# Altium schematic sheet USB_HUB.SchDoc
size A4; SheetNumber: 7; SheetTotal: 7
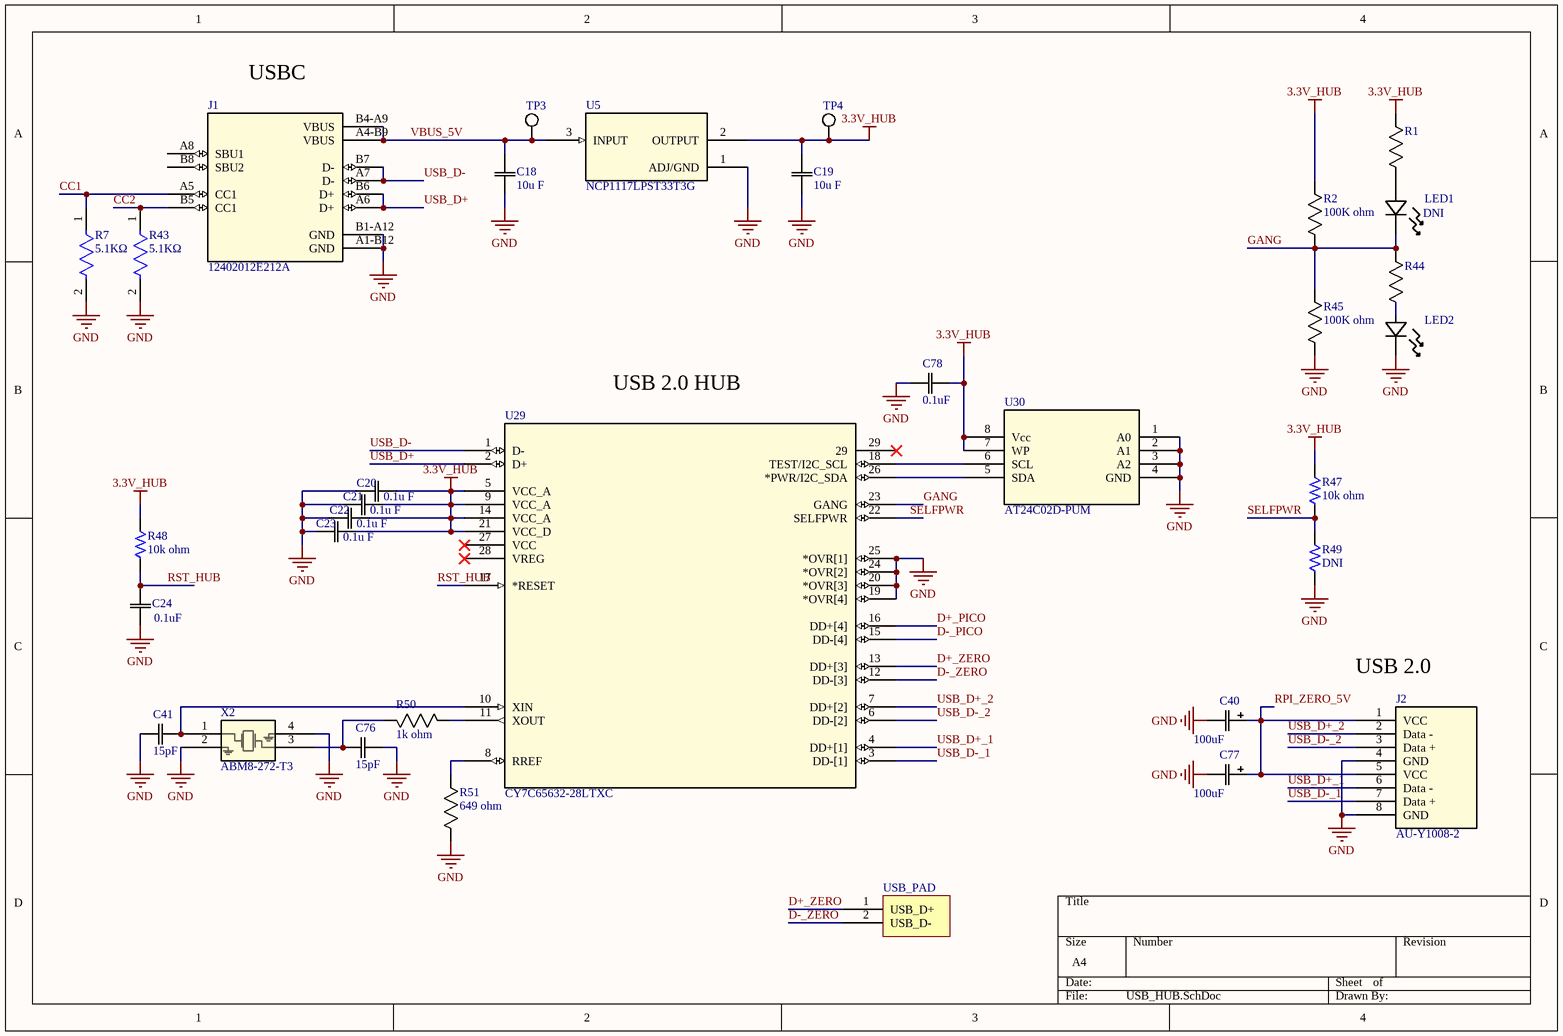
[diagram p0: USB_HUB.SchDoc]

## Parts
C18  value 10u F  [G-21_MUR-M]  (hidden comment: GRM21BR61C106KE15K)
C19  value 10u F  [G-21_MUR-M]  (hidden comment: GRM21BR61C106KE15K)
C20  value 0.1u F  [CC0805N_YAG-M]  (hidden comment: CC0805KRX7R9BB104)
C21  value 0.1u F  [CC0805N_YAG-M]  (hidden comment: CC0805KRX7R9BB104)
C22  value 0.1u F  [CC0805N_YAG-M]  (hidden comment: CC0805KRX7R9BB104)
C23  value 0.1u F  [CC0805N_YAG-M]  (hidden comment: CC0805KRX7R9BB104)
C24  value 0.1uF  [CC0805N_YAG-M]  (hidden comment: CC0805KRX7R9BB104)
C40  value 100uF  [CAP_YX_6P3X11_RUB]  (hidden comment: 35YXJ100M6.3X11)
C41  value 15pF  [CAP_CC0805_YAG-M]  (hidden comment: CC0805FRNPO9BN150)
C76  value 15pF  [CAP_CC0805_YAG-M]  (hidden comment: CC0805FRNPO9BN150)
C77  value 100uF  [CAP_YX_6P3X11_RUB]  (hidden comment: 35YXJ100M6.3X11)
C78  value 0.1uF  [CC0805N_YAG-M]  (hidden comment: CC0805KRX7R9BB104)
J1  12402012E212A  [AMPHENOL_12402012E212A]
J2  AU-Y1008-2  [CONN_AU-Y1008-2_ASM]
LED1  Parameter 1: DNI  [LED_B1931NG_HVK]  (hidden comment: B1931NG--20D001114U1930)
LED2  B1931NG--20D001114U1930  [LED_B1931NG_HVK]  (value not drawn)
R1  RC0603FR-07169RL  [RC0603N_YAG-M]  (value not drawn)
R2  value 100K ohm  [RC0805N_YAG-M]  (hidden comment: RC0805FR-07100KL)
R7  Resistance: 5.1KΩ  [FP-RT0805-MFG]  (hidden comment: RT0805FRE075K1L)
R43  Resistance: 5.1KΩ  [FP-RT0805-MFG]  (hidden comment: RT0805FRE075K1L)
R44  RC0603FR-07169RL  [RC0603N_YAG-M]  (value not drawn)
R45  value 100K ohm  [RC0805N_YAG-M]  (hidden comment: RC0805FR-07100KL)
R47  value 10k ohm  [STA_RNCP0805_STP-M]  (hidden comment: RNCP0805FTD10K0)
R48  value 10k ohm  [STA_RNCP0805_STP-M]  (hidden comment: RNCP0805FTD10K0)
R49  value DNI  [STA_RNCP0805_STP-M]  (hidden comment: RNCP0805FTD10K0)
R50  value 1k ohm  [RES_RNCF0805_STP-M]  (hidden comment: RNCF0805DTE1K00)
R51  value 649 ohm  [RES_RNCF0805_STP-M]  (hidden comment: RLC73K2AR649FTD)
TP3  TestPoint  [Testpoint]  (value not drawn)
TP4  TestPoint  [Testpoint]  (value not drawn)
U5  NCP1117LPST33T3G  [SOT223-3_ONS-M]
U29  CY7C65632-28LTXC  [QFN-28-M]
U30  AT24C02D-PUM  [PDIP8_300MC_MCH]
USB_PAD  USB_PAD  [USB_PAD]  (value not drawn)
X2  ABM8-272-T3  [ABM8-272-T3_ABR]

## Nets
3.3V_HUB: C19.2 C20.1 C21.1 C22.1 C23.1 C78.1 R1.1 R2.2 R47.2 R48.2 TP4.1 U5.2(OUTPUT) U29.5(VCC_A) U29.9(VCC_A) U29.14(VCC_A) U29.21(VCC_D) U30.7(WP) U30.8(Vcc)
GND: C18.1 C19.1 C20.2 C21.2 C22.2 C23.2 C24.1 C40.2 C41.1 C76.2 C77.2 C78.2 J1.A1-B12(GND) J1.B1-A12(GND) J2.4(GND) J2.8(GND) LED2.1(CATHODE) R7.2 R43.2 R45.1 R49.1 R51.1 U5.1(ADJ/GND) U29.19(*OVR[4]) U29.20(*OVR[3]) U29.24(*OVR[2]) U29.25(*OVR[1]) U30.1(A0) U30.2(A1) U30.3(A2) U30.4(GND) X2.2 X2.4
CC1: J1.A5(CC1) R7.1
CC2: J1.B5(CC1) R43.1
D+_PICO: U29.16(DD+[4])
D+_ZERO: U29.13(DD+[3]) USB_PAD.1(USB_D+)
D-_PICO: U29.15(DD-[4])
D-_ZERO: U29.12(DD-[3]) USB_PAD.2(USB_D-)
GANG: LED1.1(CATHODE) R2.1 R44.1 R45.2 U29.23(GANG)
RPI_ZERO_5V: C40.1 C77.1 J2.1(VCC) J2.5(VCC)
RST_HUB: C24.2 R48.1 U29.17(*RESET)
SELFPWR: R47.1 R49.2 U29.22(SELFPWR)
USB_D+: J1.A6(D+) J1.B6(D+) U29.2(D+)
USB_D+_1: J2.6(Data_-) U29.4(DD+[1])
USB_D+_2: J2.2(Data_-) U29.7(DD+[2])
USB_D-: J1.A7(D-) J1.B7(D-) U29.1(D-)
USB_D-_1: J2.7(Data_+) U29.3(DD-[1])
USB_D-_2: J2.3(Data_+) U29.6(DD-[2])
VBUS_5V: C18.2 J1.A4-B9(VBUS) J1.B4-A9(VBUS) TP3.1 U5.3(INPUT)
NetC41_2: C41.2 U29.10(XIN) X2.1
NetC76_1: C76.1 R50.2 X2.3
NetLED1_2: LED1.2(ANODE) R1.2
NetLED2_2: LED2.2(ANODE) R44.2
NetR50_1: R50.1 U29.11(XOUT)
NetR51_2: R51.2 U29.8(RREF)
NetU29_18: U29.18(TEST/I2C_SCL) U30.6(SCL)
NetU29_26: U29.26(*PWR/I2C_SDA) U30.5(SDA)

Not connected (* = marked no-connect by the designer): J1 A8(SBU1) B8(SBU2); U29 27(VCC)* 28(VREG)* 29*

## Notes on the sheet
- (near J1) USBC
- USB 2.0 HUB
- (near J2) USB 2.0

## Library data of the parts
C18 C19 = CAP_GRM21BR61C106KE15K: 10 µF ±10% 16V Ceramic Capacitor X5R 0805 (2012 Metric); Mfr_Name: Murata
C20-C24 C78 = CAP_CC0805KRX7R9BB104: 0.1 µF ±10% 50V Ceramic Capacitor X7R 0805 (2012 Metric); Mfr_Name: Yageo
C40 C77 = CAP_35YXJ100M6.3X11: CAP ALUM 100UF 20% 35V RADIAL TH; Mfr_Name: Rubycon
C41 C76 = CAP_CC0805FRNPO9BN150: 15 pF ±1% 50V Ceramic Capacitor C0G, NP0 0805 (2012 Metric); Mfr_Name: Yageo
J1 = 12402012E212A: CONN RCP USB2.0 TYP C 24P SMD RA; Mfr_Name: Amphenol ICC; RefDes: RefDes; Type: Type
J2 = AU-Y1008-2: No Description Available; Mfr_Name: Assmann; RefDes: RefDes; Type: Type
LED1 LED2 = LED_B1931NG--20D001114U1930: Green 525nm LED Indication - Discrete 3.3V 0603 (1608 Metric); Mfr_Name: Harvatek; Type: LED Indication
R1 R44 = RES_RC0603FR-07169RL: 169 Ohms ±1% 0.1W, 1/10W Chip Resistor 0603 (1608 Metric) Moisture Resistant Thick Film; Mfr_Name: Yageo
R2 R45 = RES_RC0805FR-07100KL: 100 kOhms ±1% 0.125W, 1/8W Chip Resistor 0805 (2012 Metric) Moisture Resistant Thick Film; Mfr_Name: Yageo
R7 R43 = CMP-2001-01539-2: RES SMD 5.1K OHM 1% 1/8W 0805; Manufacturer: Yageo; Temperature Coefficient: 50 ppm/°C; Tolerance: 0.0001; Value: 5.1KΩ; Voltage Rating: 150V; Power Rating: 0.125W; Ipc Land Pattern Name: RESC200125X50; Digikey Description: RES SMD 5.1K OHM 1% 1/8W 0805; Composition: Thin Film; Category: Res; Device Class L2: Resistors; Manufacturer Part Number: RT0805FRE075K1L; Octopart: https://octopart.com/rt0805fre075k1l-yageo-1396245; Series: RT; Lead Free: Yes; ComponentLink2URL: http://www.yageo.com/documents/recent/PYu-RT_1-to-0.01_RoHS_L_9.pdf; Height: 0.6mm; Device Class L1: Passive Components; Footprint Url: http://www.yageo.com/exep/pages/download/literatures/PYu-R_Mount_10.pdf; Package: RT0805; Temperature Range Low: -55°C; Automotive: No; RoHS: TRUE; Temperature Range High: +155°C; Temperature: -55°C to +155°C; ComponentLink2Description: Datasheet; Mouser Description: Res Thin Film 0805 5.1K Ohm 1% 1/8W ±50ppm/°C Molded SMD SMD Paper T/R; Device Class L3: Chip SMD Resistors
R47-R49 = RES_RNCP0805FTD10K0: 10 kOhms ±1% 0.25W, 1/4W Chip Resistor 0805 (2012 Metric) Anti-Sulfur Thin Film; Supplier 1: Digikey; Supplier Part Number 1: RNCP0805FTD10K0CT-ND
R50 = RES_RNCF0805DTE1K00: 1 kOhms ±0.5% 0.25W, 1/4W Chip Resistor 0805 (2012 Metric) Automotive AEC-Q200 Thin Film; Mfr_Name: Stackpole International
R51 = RES_RLC73K2AR649FTD: 649 mOhms ±1% 0.125W, 1/8W Chip Resistor 0805 (2012 Metric) Current Sense Thick Film; Mfr_Name: Stackpole International
U5 = NCP1117LPST33T3G: Linear Voltage Regulator IC Positive Fixed 1 Output 1A SOT-223; Mfr_Name: onsemi; RefDes: RefDes; Type: Type
U29 = CY7C65632-28LTXC: USB Hub Controller USB 2.0 USB Interface 28-QFN (5x5); Mfr_Name: Cypress Semiconductor; RefDes: RefDes; Type: Type
U30 = AT24C02D-PUM: IC EEPROM 2KBIT I2C 1MHZ 8DIP; Mfr_Name: Microchip; RefDes: RefDes; Type: Type
X2 = ABM8-272-T3: 12 MHz ±30ppm Crystal 10pF 50 Ohms 4-SMD, No Lead; Mfr_Name: Abracon; Type: Crystals; RefDes: RefDes